# Altium schematic sheet LightSensorsButtons.SchDoc
size A
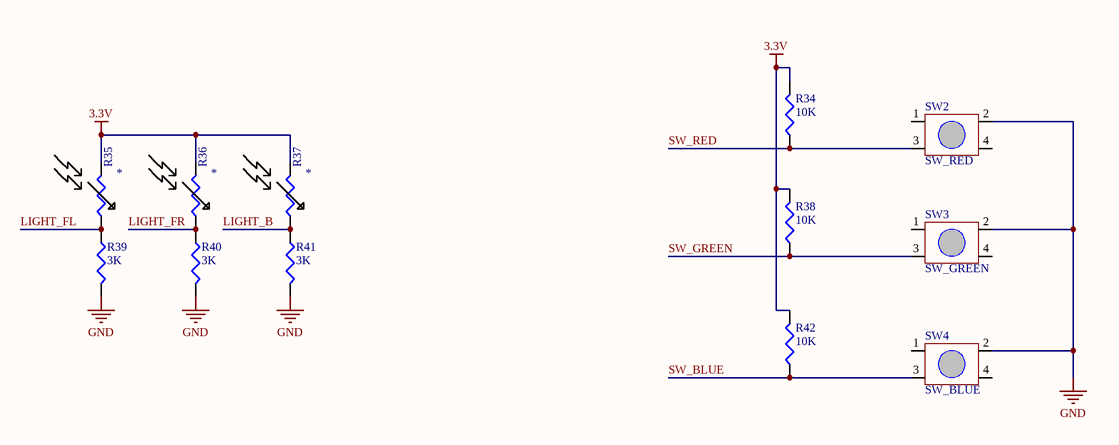
[diagram p0: LightSensorsButtons.SchDoc]

## Parts
R34  value 10K  [RESC1608L]  (hidden comment: Res3)
R35  photoresistor  [photoresistor]  (value not drawn)
R36  photoresistor  [photoresistor]  (value not drawn)
R37  photoresistor  [photoresistor]  (value not drawn)
R38  value 10K  [RESC1608L]  (hidden comment: Res3)
R39  value 3K  [RESC1608L]  (hidden comment: Res3)
R40  value 3K  [RESC1608L]  (hidden comment: Res3)
R41  value 3K  [RESC1608L]  (hidden comment: Res3)
R42  value 10K  [RESC1608L]  (hidden comment: Res3)
SW2  SW_RED  [SwitchTall-TL330]
SW3  SW_GREEN  [SwitchTall-TL330]
SW4  SW_BLUE  [SwitchTall-TL330]

## Nets
3.3V: R34.2 R35.2 R36.2 R37.2 R38.2 R42.2
GND: R39.2 R40.2 R41.2 SW2.2 SW3.2 SW4.2
LIGHT_B: R37.1 R41.1
LIGHT_FL: R35.1 R39.1
LIGHT_FR: R36.1 R40.1
SW_BLUE: R42.1 SW4.3
SW_GREEN: R38.1 SW3.3
SW_RED: R34.1 SW2.3

Not connected (* = marked no-connect by the designer): SW2 1 4; SW3 1 4; SW4 1 4

## Library data of the parts
R34 R38-R42 = Res3: Resistor; Published: 8-Jun-2000; LatestRevisionDate: 29-May-2009; LatestRevisionNote: IPC-7351 Footprint Added.; PackageReference: J1-0603; Publisher: Altium Limited; PackageDescription: Chip Resistor
SW2-SW4 = Switch-TL330
R35-R37 = photoresistor: Value: *